# EAGLE design FM_module_TEA5767 (EAGLE 7.6.0)
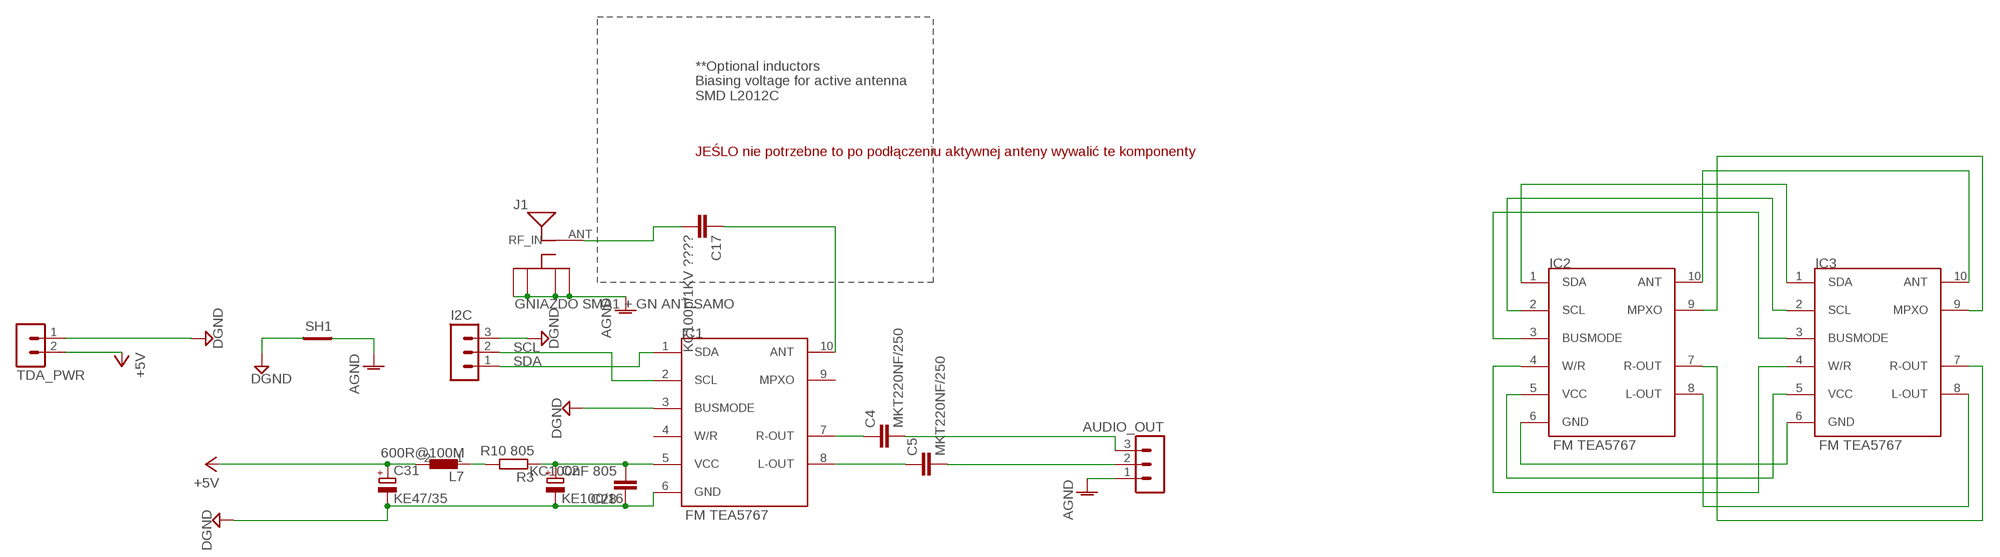
[diagram p0: schematic, sheet 1]

## Parts
AUDIO_OUT  MA03-1  [MA03-1]
C2  KE100/16  CPOL-EUTT2D6  [TT2D6]
C4  MKT220NF/250  C-EU050-050X075  [C050-050X075]
C5  MKT220NF/250  C-EU050-050X075  [C050-050X075]
C17  KC100p/1KV ????  C-EU050-025X075  [C050-025X075]
C28  KC100nF 805  C-EUC0805  [C0805]
C31  KE47/35  CPOL-EUTT2D6  [TT2D6]
I2C  MA03-1  [MA03-1]
IC1  FM TEA5767  TEA5767_MODULE_2.54MM  [PROTOTYPE]
IC2  FM TEA5767  TEA5767_MODULE_2.54MM  [PROTOTYPE]
IC3  FM TEA5767  TEA5767_MODULE_SMD  [SMD]
J1  GNIAZDO SMA1 + GN ANT SAMO  J_SMA_TYCO_1053378  [1053378-1]
L7  600R@100M  FERRITR0805  [R0805]
R3  R10 805  R-EU_R0805  [R0805]
SH1  SHORT-HT5  [SHORT_TOP-50]
TDA_PWR  MA02-1  [MA02-1]

## Nets
+5V: C31.+ L7.2 TDA_PWR.2
AGND: AUDIO_OUT.1 J1.GND_1(RFGND_1) J1.GND_2(RFGND_2) J1.GND_3(RFGND_3) J1.GND_4(RFGND_4) SH1.2
DGND: C2.- C28.1 C31.- I2C.3 IC1.3(BUSMODE) IC1.6(GND) SH1.1 TDA_PWR.1
N$1: C17.2 J1.ANT(RF_IN)
N$2: IC2.1(SDA) IC3.1(SDA)
N$4: C2.+ C28.2 IC1.5(VCC) R3.1
N$6: C17.1 IC1.10(ANT)
N$7: IC2.2(SCL) IC3.2(SCL)
N$8: C4.1 IC1.7(R-OUT)
N$9: C5.1 IC1.8(L-OUT)
N$10: IC2.3(BUSMODE) IC3.3(BUSMODE)
N$11: IC2.10(ANT) IC3.10(ANT)
N$12: IC2.9(MPXO) IC3.9(MPXO)
N$13: IC2.6(GND) IC3.6(GND)
N$14: IC2.5(VCC) IC3.5(VCC)
N$15: IC2.4(W/R) IC3.4(W/R)
N$16: L7.1 R3.2
N$17: IC2.8(L-OUT) IC3.8(L-OUT)
N$18: IC2.7(R-OUT) IC3.7(R-OUT)
N$41: AUDIO_OUT.3 C4.2
N$42: AUDIO_OUT.2 C5.2
SCL: I2C.2 IC1.2(SCL)
SDA: I2C.1 IC1.1(SDA)
Unconnected: IC1.4(W/R) IC1.9(MPXO)

## Notes on the sheet
- **Optional inductors
  Biasing voltage for active antenna
  SMD L2012C
- JEŚLO nie potrzebne to po podłączeniu aktywnej anteny wywalić te komponenty

## Library data of the parts
AUDIO_OUT I2C = con-lstb:MA03-1: PIN HEADER; OC_FARNELL: unknown; OC_NEWARK: unknown
C2 C31 = rcl:CPOL-EU: POLARIZED CAPACITOR, European symbol
C4 C5 C17 C28 = rcl:C-EU: CAPACITOR, European symbol
IC1-IC3 = TEA5767_module:TEA5767_MODULE_
J1 = j_sma_tyco_1053378-1:J_SMA_TYCO_1053378: Tyco SMA Antenna
L7 = ferrit_bear:FERRIT
R3 = rcl:R-EU_: RESISTOR, European symbol
SH1 = shorts-old:SHORT-H: Short between two nets; BOM: no
TDA_PWR = con-lstb_SileliS:MA02-1: PIN HEADER

## Board
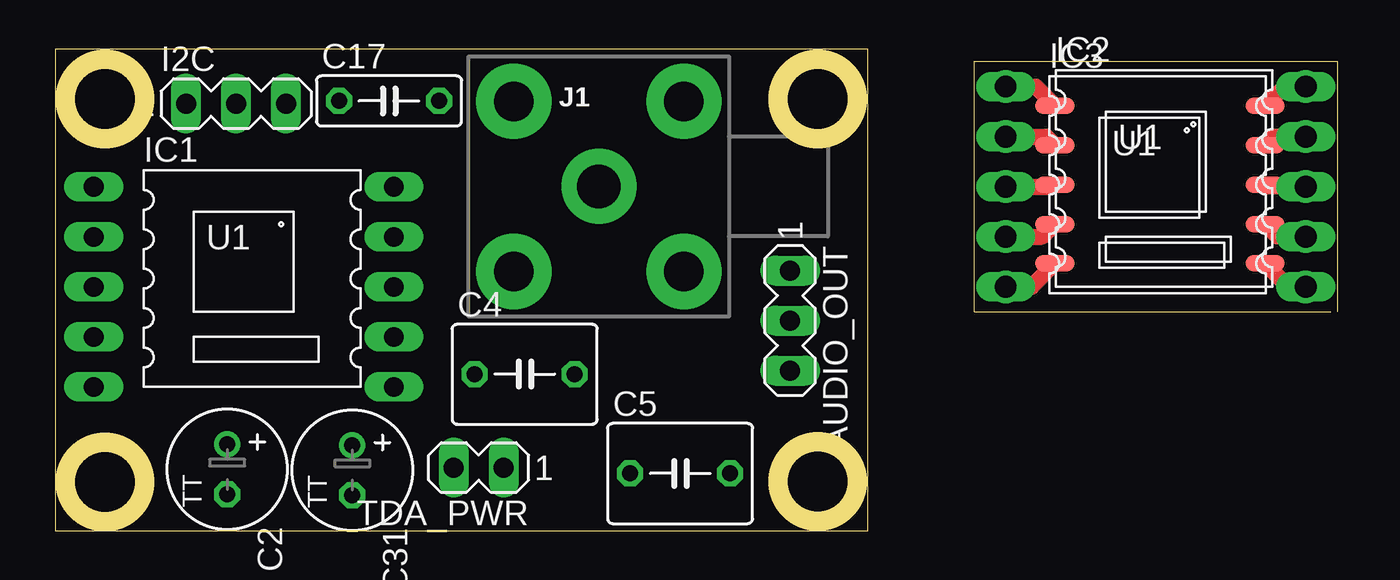
[diagram p1: board, top side]
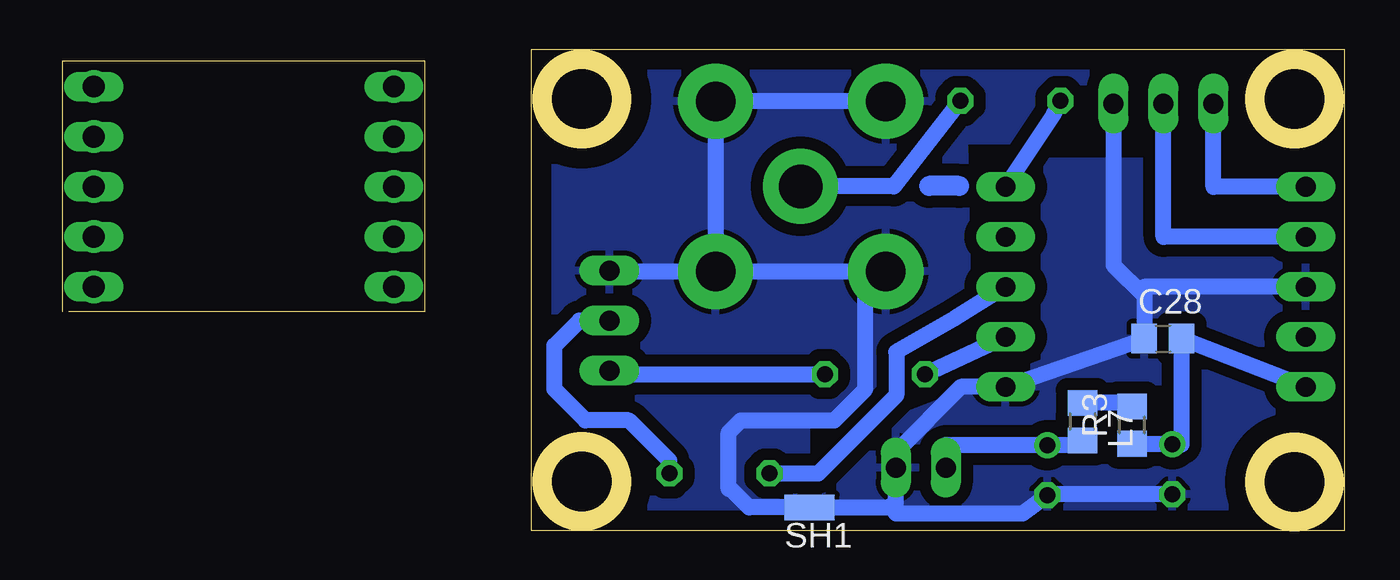
[diagram p2: board, bottom side, seen from below]

Size 65.08 x 24.44 mm. Coordinates in mm from the lower left corner, seen from the top.
Outline: 65.08,11.11 65.08,23.82 46.66,23.82 46.66,11.11 64.76,11.11
Outline: 0,0 41.27,0 41.27,24.44 0,24.44 0,0
Outline: circle at 38.7,21.92 radius 2
Outline: circle at 38.71,2.49 radius 2
Outline: circle at 2.51,21.91 radius 2
Outline: circle at 2.51,2.47 radius 2
Copper layers (1*16): Top 0.035mm / dielectric 1.5mm / Bottom 0.035mm
Design rules "default": minimum track width 10mil, minimum drill 24mil, track to track 8mil, track to pad 8mil, pad to pad 8mil, via to via 8mil, smd to smd 8mil, copper to edge 40mil, drill to drill 8mil, minimum pad ring 10mil, minimum via ring 8mil, stop-mask expansion 4mil, vias tented up to drill 0mil, thermal gap 10mil

### Footprints (pad centres in the part's own frame; a part is rotated, then mirrored left to right if it is on the bottom)
MA03-1 = drill 1.016 long: 1 -2.54,0; 2 0,0; 3 2.54,0
TT2D6 = drill 0.813: + -1.27,0 | drill 0.813 octagon: - 1.27,0
C050-050X075 = drill 0.813 octagon: 1 -2.54,0; 2 2.54,0
C050-025X075 = drill 0.813 octagon: 1 -2.54,0; 2 2.54,0
C0805 = smd 1.3 x 1.5: 1 -0.95,0; 2 0.95,0
PROTOTYPE = drill 1 pad 1.27 long: 1 -7.62,3.81; 2 -7.62,1.27; 3 -7.62,-1.27; 4 -7.62,-3.81; 5 -7.62,-6.35; 6 7.62,-6.35; 7 7.62,-3.81; 8 7.62,-1.27; 9 7.62,1.27; 10 7.62,3.81
SMD = smd 2 x 0.85: 1 -4.8,3.15; 2 -4.8,1.15; 3 -4.8,-0.85; 4 -4.8,-2.85; 5 -4.8,-4.85; 6 5.866,-4.85; 7 5.866,-2.85; 8 5.866,-0.85; 9 5.866,1.16; 10 5.866,3.15
1053378-1 = drill 2.2 pad 3.81: ANT 0,0 | drill 2 pad 3.81: GND_1 4.318,4.318; GND_2 4.318,-4.318; GND_3 -4.318,4.318; GND_4 -4.318,-4.318
R0805 = smd 1.3 x 1.5: 1 -0.95,0; 2 0.95,0
SHORT_TOP-50 = smd 1.27 x 1.27: 1 0.635,0; 2 -0.635,0
MA02-1 = drill 1.016 long: 1 -2.54,0; 2 0,0

### Placement (x,y rotation side)
AUDIO_OUT  37.3,10.66 270 top
C2  8.72,3.11 270 top
C4  23.83,7.94 0 top
C5  31.72,2.9 0 top
C17  16.94,21.82 0 top
C28  9.2,9.75 0 bottom
C31  15.08,3.08 270 top
I2C  9.17,21.68 0 top
IC1  9.57,13.64 0 top
IC2  55.87,18.73 0 top
IC3  55.55,18.41 0 top
J1  27.59,17.47 0 top
L7  13.28,5.54 270 bottom
R3  10.77,5.36 90 bottom
SH1  27.14,1.18 0 bottom
TDA_PWR  20.23,3.2 180 top

### Tracks (layer width: path | path; a pad name or v marks a point on that pad's centre or on a via)
+5V
  Bottom 0.813: L7.2 13.52,4.35 C31.+ 20.23,4.35 TDA_PWR.2
AGND
  Bottom 0.813: J1.GND_3 J1.GND_1 J1.GND_2 | J1.GND_2 24,13.16 | 24,13.16 J1.GND_4 | AUDIO_OUT.1 37.26,13.16 J1.GND_2 | 31.26,2.12 31.26,2.22 | 31.26,2.22 31.26,4.97 30.63,5.6 25.89,5.6 24.31,7.18 24.31,12.84 24,13.16 | SH1.2 30.21,1.18 31.26,2.22
  pour Bottom (isolate 0.61): 12.31,25.13 41.89,25.13 42.21,-1.44 27.3,-1.44 27.3,5.72 19.04,8.34 19.27,19.81 12.31,19.81
DGND
  Bottom 0.813: C2.- 15.04,1.84 C31.- 16.33,0.87 22.73,0.87 22.77,0.9 22.77,1.5 | 22.77,1.5 TDA_PWR.1 22.77,3.99 19.46,7.29 IC1.6 C28.1 10.15,11.92 | IC1.3 10.15,12.37 10.15,11.92 | SH1.1 23.09,1.18 22.77,1.5 | I2C.3 11.71,13.48 10.15,11.92
  pour Bottom (isolate 0.61): -1.28,18.73 15.23,18.73 15.23,8.55 26.66,4.13 26.66,-1.59 -1.28,-1.59
N$1
  Bottom 0.813: C17.2 22.87,17.47 J1.ANT
N$2
  Top 0.813: IC2.1 49.78,22.54 IC3.1
N$3
  Bottom 1.016: 19.55,17.51 21.07,17.51
N$4
  Bottom 0.813: IC1.5 C28.2 8.25,4.38 C2.+ 8.72,4.41 R3.1
N$5  (via drill 1.1)
  other vias: 48.25,20
N$6
  Bottom 0.813: C17.1 14.71,21.19 IC1.10
N$7
  Top 0.813: IC2.2 50.32,20 IC3.2
N$8
  Bottom 0.813: C4.1 IC1.7
N$9
  Bottom 0.813: IC1.8 19.75,10.79 22.73,9.08 22.73,6.87 26.7,2.9 C5.1
N$10
  Top 0.813: IC2.3 50.65,17.46 IC3.3
N$11
  Top 0.813: IC2.10 62.4,22.54 IC3.10
N$12
  Top 0.813: IC2.9 61.85,20 IC3.9
N$13
  Top 0.813: IC2.6 62.6,12.38 IC3.6
N$14
  Top 0.813: IC2.5 49.57,12.38 IC3.5
N$15
  Top 0.813: IC2.4 50.11,14.92 IC3.4
N$16
  Bottom 0.813: R3.2 10.95,6.49 L7.1
N$17
  Top 0.813: IC2.8 61.52,17.46 IC3.8
N$18
  Top 0.813: IC2.7 62.06,14.92 IC3.7
N$19  (via drill 1.1)
  other vias: 48.25,22.54
N$20  (via drill 1.1)
  other vias: 48.25,17.46
N$21  (via drill 1.1)
  other vias: 48.25,14.92
N$22  (via drill 1.1)
  other vias: 48.25,12.38
N$23  (via drill 1.1)
  other vias: 63.49,22.54
N$24  (via drill 1.1)
  other vias: 63.49,20
N$25  (via drill 1.1)
  other vias: 63.49,17.46
N$26  (via drill 1.1)
  other vias: 63.49,14.92
N$27  (via drill 1.1)
  other vias: 63.49,12.38
N$41
  Bottom 0.813: AUDIO_OUT.3 37.13,7.94 C4.2
N$42
  Bottom 0.813: C5.2 34.26,3.56 36.31,5.6 38.52,5.6 40.1,7.18 40.1,9.39 38.83,10.66 AUDIO_OUT.2
SCL
  Bottom 0.813: IC1.2 9.17,14.91 I2C.2
SDA
  Bottom 0.813: IC1.1 6.63,17.45 I2C.1

### Text on the board
Document: SDA / SLC / GND